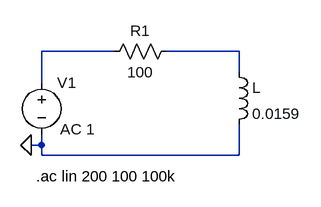
[diagram p0: schematic 3-2.asc]
3-2.asc, the LTspice schematic file:
Version 4.1
SHEET 1 880 680
WIRE 80 80 -32 80
WIRE 272 80 160 80
WIRE 272 112 272 80
WIRE -32 128 -32 80
WIRE -32 224 -32 208
WIRE -32 224 -48 224
WIRE -32 240 -32 224
WIRE 272 240 272 192
WIRE 272 240 -32 240
FLAG -48 224 0
SYMBOL voltage -32 112 R0
WINDOW 123 29 88 Left 2
WINDOW 39 0 0 Left 0
SYMATTR Value2 AC 1
SYMATTR InstName V1
SYMATTR Value ""
SYMBOL res 176 64 R90
WINDOW 0 0 56 VBottom 2
WINDOW 3 32 56 VTop 2
SYMATTR InstName R1
SYMATTR Value 100
SYMBOL ind 256 96 R0
SYMATTR InstName L
SYMATTR Value 0.0159
SYMATTR SpiceLine Rser=1m
TEXT -40 272 Left 2 !.ac lin 200 100 100k

The netlist it stands for:
* 3-2.asc
V1 N001 0 AC 1
R1 N002 N001 100
L N002 0 0.0159 Rser=1m
.ac lin 200 100 100k
.backanno
.end